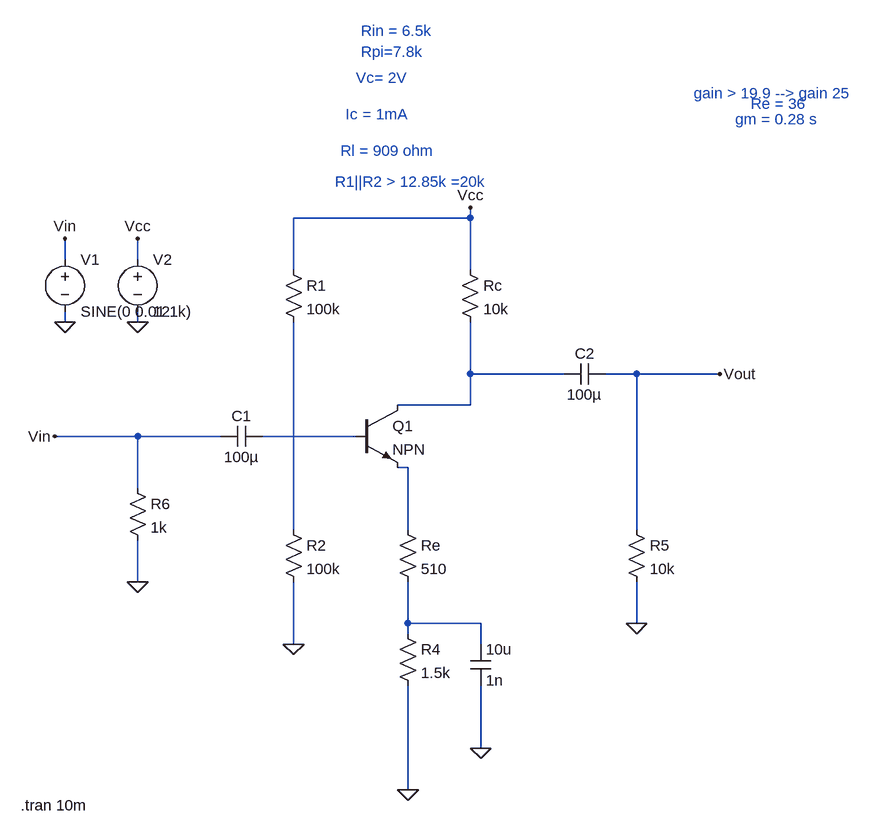
[diagram p0: schematic Draft61.asc]
Draft61.asc, the LTspice schematic file:
Version 4
SHEET 1 2280 760
WIRE 672 -160 672 -176
WIRE 672 -160 400 -160
WIRE 48 -96 48 -128
WIRE 160 -96 160 -128
WIRE 400 -80 400 -160
WIRE 672 -80 672 -160
WIRE 48 0 48 -16
WIRE 160 0 160 -16
WIRE 672 80 672 0
WIRE 816 80 672 80
WIRE 928 80 880 80
WIRE 1056 80 928 80
WIRE 672 128 672 80
WIRE 672 128 560 128
WIRE 160 176 32 176
WIRE 288 176 160 176
WIRE 496 176 352 176
WIRE 576 224 560 224
WIRE 160 256 160 176
WIRE 400 320 400 0
WIRE 576 320 576 224
WIRE 928 320 928 80
WIRE 160 400 160 336
WIRE 576 464 576 400
WIRE 688 464 576 464
WIRE 928 464 928 400
WIRE 576 480 576 464
WIRE 400 496 400 400
WIRE 688 496 688 464
WIRE 688 656 688 560
WIRE 576 720 576 560
FLAG 576 720 0
FLAG 928 464 0
FLAG 400 496 0
FLAG 160 400 0
FLAG 32 176 Vin
FLAG 1056 80 Vout
FLAG 672 -176 Vcc
FLAG 48 0 0
FLAG 160 0 0
FLAG 48 -128 Vin
FLAG 160 -128 Vcc
FLAG 688 656 0
SYMBOL voltage 48 -112 R0
WINDOW 123 0 0 Left 0
WINDOW 39 0 0 Left 0
SYMATTR InstName V1
SYMATTR Value SINE(0 0.01 1k)
SYMBOL voltage 160 -112 R0
WINDOW 123 0 0 Left 0
WINDOW 39 0 0 Left 0
SYMATTR InstName V2
SYMATTR Value 12
SYMBOL npn 496 128 R0
SYMATTR InstName Q1
SYMBOL res 384 -96 R0
SYMATTR InstName R1
SYMATTR Value 100k
SYMBOL res 384 304 R0
SYMATTR InstName R2
SYMATTR Value 100k
SYMBOL res 656 -96 R0
SYMATTR InstName Rc
SYMATTR Value 10k
SYMBOL res 560 464 R0
SYMATTR InstName R4
SYMATTR Value 1.5k
SYMBOL res 912 304 R0
SYMATTR InstName R5
SYMATTR Value 10k
SYMBOL res 144 240 R0
SYMATTR InstName R6
SYMATTR Value 1k
SYMBOL cap 352 160 R90
WINDOW 0 0 32 VBottom 2
WINDOW 3 32 32 VTop 2
SYMATTR InstName C1
SYMATTR Value 100µ
SYMBOL cap 880 64 R90
WINDOW 0 0 32 VBottom 2
WINDOW 3 32 32 VTop 2
SYMATTR InstName C2
SYMATTR Value 100µ
SYMBOL cap 672 496 R0
SYMATTR InstName 10u
SYMATTR Value 1n
SYMBOL res 560 304 R0
SYMATTR InstName Re
SYMATTR Value 510
TEXT 472 -264 Left 2 ;Rl = 909 ohm
TEXT 464 -216 Left 2 ;R1||R2 > 12.85k =20k
TEXT 480 -320 Left 2 ;Ic = 1mA
TEXT 496 -376 Left 2 ;Vc= 2V
TEXT 504 -416 Left 2 ;Rpi=7.8k
TEXT 504 -448 Left 2 ;Rin = 6.5k
TEXT 1016 -352 Left 2 ;gain > 19.9 --> gain 25
TEXT 1104 -336 Left 2 ;Re = 36
TEXT 1080 -312 Left 2 ;gm = 0.28 s
TEXT -20 744 Left 2 !.tran 10m

The netlist it stands for:
* Draft61.asc
V1 Vin 0 SINE(0 0.01 1k)
V2 Vcc 0 12
Q1 N001 N002 N003 0 NPN
R1 Vcc N004 100k
R2 N004 0 100k
Rc Vcc N001 10k
R4 N005 0 1.5k
R5 Vout 0 10k
R6 Vin 0 1k
C1 N002 Vin 100µ
C2 Vout N001 100µ
C§10u N005 0 1n
Re N003 N005 510
.model NPN NPN
.model PNP PNP
.lib standard.bjt
* Rl = 909 ohm
* R1||R2 > 12.85k =20k
* Ic = 1mA
* Vc= 2V
* Rpi=7.8k
* Rin = 6.5k
* gain > 19.9 --> gain 25
* Re = 36
* gm = 0.28 s
.tran 10m
.backanno
.end